# Altium project flyback_main_PS.PrjPcb
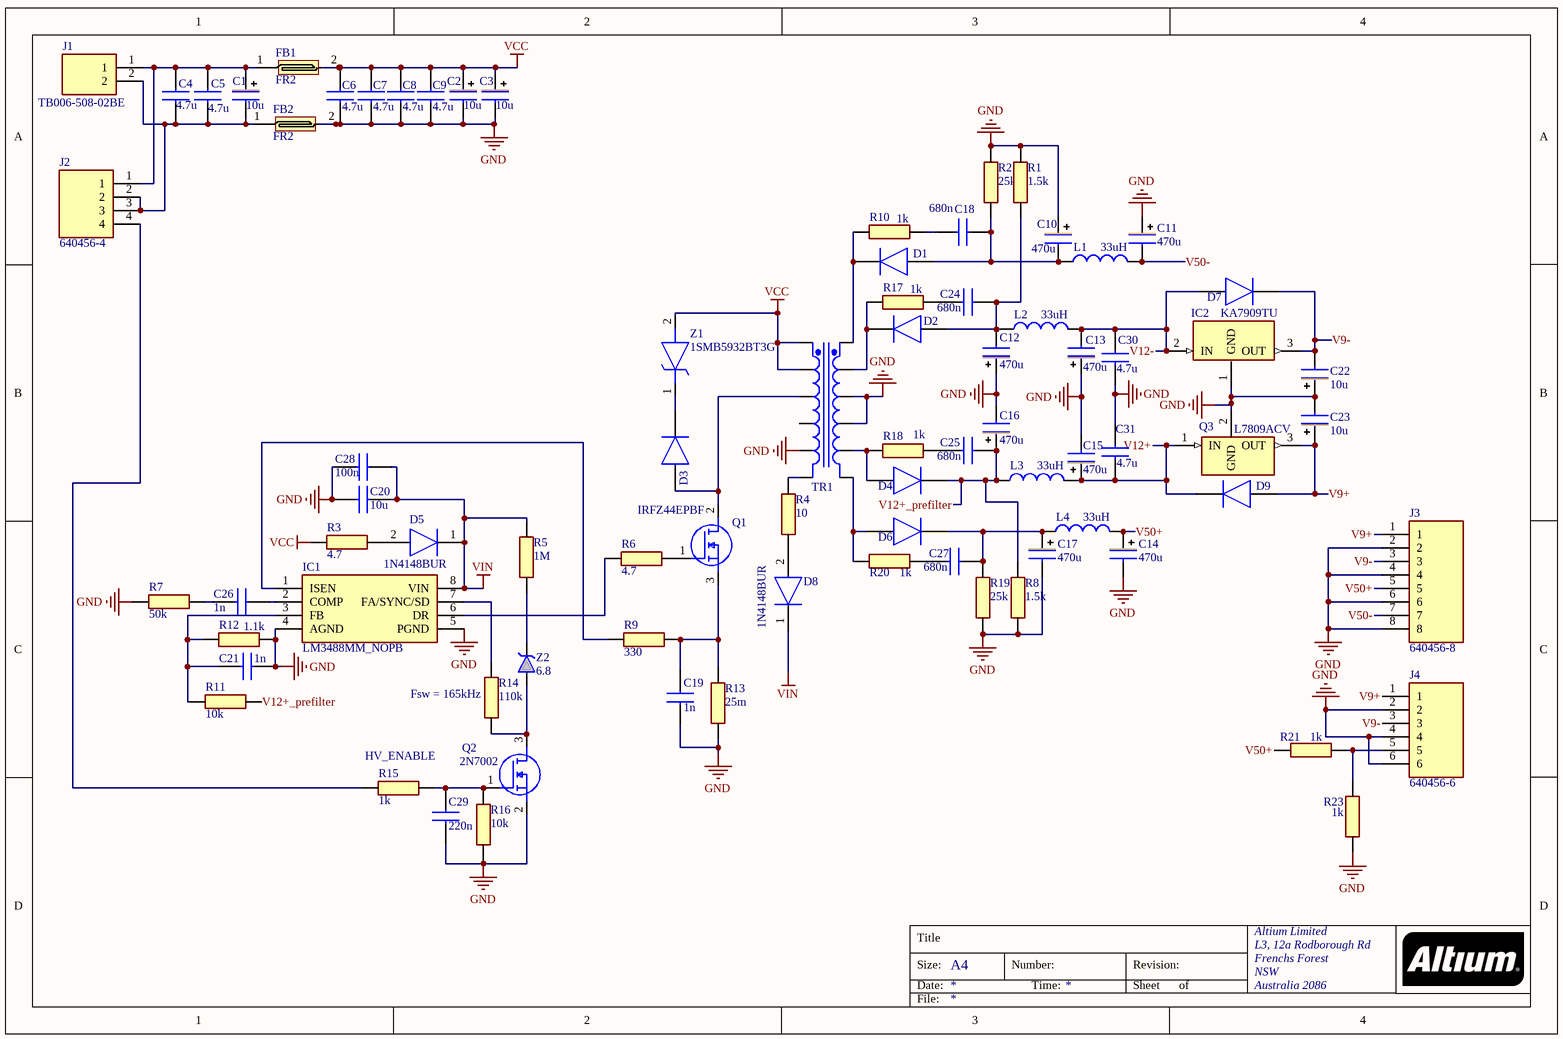
[diagram p0: PS.SchDoc]
1 sheet, 80 parts. Net scope: global (net labels, ports and power ports of the same name join across sheets).
Board file: PS.PcbDoc

## Sheet PS.SchDoc
size A4; Organization: Altium Limited; Address1: L3, 12a Rodborough Rd; Address2: Frenchs Forest; Address3: NSW; Address4: Australia 2086

### Parts
C1  value 10u  [CapPol8mm]  (hidden comment: CapPol)
C2  value 10u  [CapPol8mm]  (hidden comment: CapPol)
C3  value 10u  [CapPol8mm]  (hidden comment: CapPol)
C4  value 4.7u  [CAPC2012X140N]  (hidden comment: Capacitor_SMD)
C5  value 4.7u  [CAPC2012X140N]  (hidden comment: Capacitor_SMD)
C6  value 4.7u  [CAPC2012X140N]  (hidden comment: Capacitor_SMD)
C7  value 4.7u  [CAPC2012X140N]  (hidden comment: Capacitor_SMD)
C8  value 4.7u  [CAPC2012X140N]  (hidden comment: Capacitor_SMD)
C9  value 4.7u  [CAPC2012X140N]  (hidden comment: Capacitor_SMD)
C10  value 470u  [Cap_pol_5x13]  (hidden comment: CapPol)
C11  value 470u  [Cap_pol_5x13]  (hidden comment: CapPol)
C12  value 470u  [CapPol_D10H16]  (hidden comment: CapPol)
C13  value 470u  [CapPol_D10H16]  (hidden comment: CapPol)
C14  value 470u  [Cap_pol_5x13]  (hidden comment: CapPol)
C15  value 470u  [CapPol_D10H16]  (hidden comment: CapPol)
C16  value 470u  [CapPol_D10H16]  (hidden comment: CapPol)
C17  value 470u  [Cap_pol_5x13]  (hidden comment: CapPol)
C18  value 680n  [CAPC3216X95N]  (hidden comment: Capacitor_SMD)
C19  value 1n  [CAPC2012X140N]  (hidden comment: Capacitor_SMD)
C20  value 10u  [CAPC2012X140N]  (hidden comment: Capacitor_SMD)
C21  value 1n  [CAPC2012X140N]  (hidden comment: Capacitor_SMD)
C22  value 10u  [CapPol_D10H16]  (hidden comment: CapPol)
C23  value 10u  [CapPol_D10H16]  (hidden comment: CapPol)
C24  value 680n  [CAPC3216X95N]  (hidden comment: Capacitor_SMD)
C25  value 680n  [CAPC3216X95N]  (hidden comment: Capacitor_SMD)
C26  value 1n  [CAPC2012X140N]  (hidden comment: Capacitor_SMD)
C27  value 680n  [CAPC3216X95N]  (hidden comment: Capacitor_SMD)
C28  value 100n  [CAPC2012X140N]  (hidden comment: Capacitor_SMD)
C29  value 220n  [CAPC2012X140N]  (hidden comment: Capacitor_SMD)
C30  value 4.7u  [CAPC3216X95N]  (hidden comment: Capacitor_SMD)
C31  value 4.7u  [CAPC3216X95N]  (hidden comment: Capacitor_SMD)
D1  SS1200-LTP  [DIOM5226X244N]  (value not drawn)
D2  S2B-13-F  [DIOM5336X250N]  (value not drawn)
D3  SS1200-LTP  [DIOM5226X244N]  (value not drawn)
D4  S2B-13-F  [DIOM5336X250N]  (value not drawn)
D5  1N4148BUR  [1N4148BUR]
D6  SS1200-LTP  [DIOM5226X244N]  (value not drawn)
D7  SS1200-LTP  [DIOM5226X244N]  (value not drawn)
D8  1N4148BUR  [1N4148BUR]
D9  SS1200-LTP  [DIOM5226X244N]  (value not drawn)
FB1  FR2  [FB2]
FB2  FR2  [FB2]
IC1  LM3488MM_NOPB  [SOP65P490X110-8N]
IC2  KA7909TU  [TO254P470X1016X2019-3P]
J1  TB006-508-02BE  [TB00650802BE]
J2  640456-4  [SHDR4W66P0X254_1X4_1016X572X1041P]
J3  640456-8  [SHDR8W66P0X254_1X8_2032X572X1024P]
J4  640456-6  [SHDR6W66P0X254_1X6_1524X572X1003P]
L1  value 33uH  [TYA3015150M]  (hidden comment: Inductor)
L2  value 33uH  [TYA3015150M]  (hidden comment: Inductor)
L3  value 33uH  [TYA3015150M]  (hidden comment: Inductor)
L4  value 33uH  [TYA3015150M]  (hidden comment: Inductor)
Q1  IRFZ44EPBF  [TO254P469X1042X1967-3P]
Q2  2N7002  [SOT96P240X120-3N]
Q3  L7809ACV  [TO255P460X1020X2030-3P]
R1  value 1.5k  [RESC3216X75N]  (hidden comment: Res_SMD)
R2  value 25k  [RESC3216X75N]  (hidden comment: Res_SMD)
R3  value 4.7  [RESC2012X60N]  (hidden comment: Res_SMD)
R4  value 10  [RESC2012X60N]  (hidden comment: Res_SMD)
R5  value 1M  [RESC2012X60N]  (hidden comment: Res_SMD)
R6  value 4.7  [RESC2012X60N]  (hidden comment: Res_SMD)
R7  value 50k  [RESC2012X60N]  (hidden comment: Res_SMD)
R8  value 1.5k  [RESC3216X75N]  (hidden comment: Res_SMD)
R9  value 330  [RESC2012X60N]  (hidden comment: Res_SMD)
R10  value 1k  [RESC5025X65N]  (hidden comment: Res_SMD)
R11  value 10k  [RESC2012X60N]  (hidden comment: Res_SMD)
R12  value 1.1k  [RESC2012X60N]  (hidden comment: Res_SMD)
R13  value 25m  [RESC6331X75N]  (hidden comment: Res_SMD)
R14  value 110k  [RESC2012X60N]  (hidden comment: Res_SMD)
R15  value 1k  [RESC2012X60N]  (hidden comment: Res_SMD)
R16  value 10k  [RESC2012X60N]  (hidden comment: Res_SMD)
R17  value 1k  [RESC5025X65N]  (hidden comment: Res_SMD)
R18  value 1k  [RESC5025X65N]  (hidden comment: Res_SMD)
R19  value 25k  [RESC3216X75N]  (hidden comment: Res_SMD)
R20  value 1k  [RESC5025X65N]  (hidden comment: Res_SMD)
R21  value 1k  [RESC3216X75N]  (hidden comment: Res_SMD)
R23  value 1k  [RESC3216X75N]  (hidden comment: Res_SMD)
TR1  Transformer 12pin30.15.7  [TRAFO5mmX25mm12pcs]  (value not drawn)
Z1  1SMB5932BT3G  [DIOM5436X247N]
Z2  value 6.8  [SOD-80]  (hidden comment: Zener)

### Nets
GND: C2.2(-) C3.2(-) C6.1 C7.1 C8.1 C9.1 C10.1(+) C11.1(+) C12.1(+) C13.1(+) C14.2(-) C15.2(-) C16.2(-) C17.2(-) C19.1 C20.1 C21.2 C22.1(+) C23.2(-) C28.1 C29.1 C30.1 C31.2 FB2.2 IC1.4(AGND) IC1.5(PGND) IC2.1(GND) J3.2 J3.4 J3.6 J3.8 J4.2 J4.4 J4.6 Q2.2(S) Q3.2(GND) R1.2 R2.2 R7.1 R8.1 R12.1 R13.1 R16.1 R19.1 R23.2 TR1.5 TR1.9 TR1.10
VCC: C2.1(+) C3.1(+) C6.2 C7.2 C8.2 C9.2 FB1.2 R3.2 TR1.1 TR1.2 Z1.2(A)
VIN: C20.2 C28.2 D5.1(K) D8.1(K) IC1.8(VIN) R5.2
V9+: C23.1(+) D9.2(A) J3.1 J4.1 Q3.3(OUT)
V9-: C22.2(-) D7.1(K) IC2.3(OUT) J3.3 J4.3
V12+: C15.1(+) C31.1 D9.1(K) L3.2 Q3.1(IN)
V12+_prefilter: C16.1(+) C25.1 D4.1(K) L3.1 R8.2 R11.2
V12-: C13.2(-) C30.2 D7.2(A) IC2.2(IN) L2.2
V50+: C14.1(+) J3.5 L4.2 R21.2
V50-: C11.2(-) J3.7 L1.2
NetC1_1: C1.1(+) C4.2 C5.2 FB1.1 J1.1 J2.1
NetC1_2: C1.2(-) C4.1 C5.1 FB2.1 J1.2 J2.2 J2.3
NetC10_2: C10.2(-) C18.1 D1.2(A) L1.1 R2.1
NetC12_2: C12.2(-) C24.1 D2.2(A) L2.1 R1.1
NetC17_1: C17.1(+) C27.2 D6.1(K) L4.1 R19.2
NetC18_2: C18.2 R10.1
NetC19_2: C19.2 Q1.3(S) R9.2 R13.2
NetC21_1: C21.1 IC1.3(FB) R11.1 R12.2
NetC24_2: C24.2 R17.1
NetC25_2: C25.2 R18.1
NetC26_1: C26.1 R7.2
NetC26_2: C26.2 IC1.2(COMP)
NetC27_1: C27.1 R20.1
NetC29_2: C29.2 Q2.1(G) R15.2 R16.2
NetD1_1: D1.1(K) R10.2 TR1.12
NetD2_1: D2.1(K) R17.2 TR1.11
NetD3_1: D3.1(K) Z1.1(K)
NetD3_2: D3.2(A) Q1.2(D) TR1.3
NetD4_2: D4.2(A) R18.2 TR1.8
NetD5_2: D5.2(A) R3.1
NetD6_2: D6.2(A) R20.2 TR1.7
NetD8_2: D8.2(A) R4.1
NetIC1_1: IC1.1(ISEN) R9.1
NetIC1_6: IC1.6(DR) R6.1
NetIC1_7: IC1.7(FA/SYNC/SD) R14.2
NetJ2_4: J2.4 R15.1
NetJ4_5: J4.5 R21.1 R23.1
NetQ1_1: Q1.1(G) R6.2
NetQ2_3: Q2.3(D) R14.1 Z2.2(A)
NetR4_2: R4.2 TR1.6
NetR5_1: R5.1 Z2.1(K)

Not connected (* = marked no-connect by the designer): TR1 4

### Notes on the sheet
- (near R14) Fsw = 165kHz
- (near R15) HV_ENABLE
- Title
- Size:
- Date:
- A4
- Number:
- Time:
- Revision:
- Sheet
- of
- File:

### Library data of the parts
C1-C3 C10-C17 C22 C23 = CapPol: Capacitor polarized electrolytic; Manufacturer_Name: TDK; Manufacturer_Part_Number: B43640A9477M; Datasheet Link: https://componentsearchengine.com/Datasheets/1/B43640A9477M.pdf; Height: 52mm; Mouser Part Number: 871-B43640A9477M
C4-C9 C18-C21 C24-C31 = Capacitor_SMD: Capacitor smd ceramic; Manufacturer_Name: TDK; Manufacturer_Part_Number: C3216C0G1H562J060AA; Datasheet Link: https://product.tdk.com/info/en/catalog/datasheets/mlcc_commercial_midvoltage_en.pdf; Height: 0.75mm
D1 D3 D6 D7 D9 = SS1200-LTP: Diode; Manufacturer_Name: Micro Commercial Components (MCC); Datasheet Link: http://www.mouser.com/ds/2/258/SS1150-L-SS1200-L(DO-214AC)-272760.pdf; Height: 2.44mm; Manufacturer_Part_Number: SS1200-LTP; Mouser Part Number: 833-SS1200-LTP; Mouser Price/Stock: https://www.mouser.co.uk/ProductDetail/Micro-Commercial-Components-MCC/SS1200-LTP?qs=O1HRStiETChHpHSSFKYx%252Bg%3D%3D; Arrow Part Number: SS1200-LTP; Arrow Price/Stock: https://www.arrow.com/en/products/ss1200-ltp/micro-commercial-components
D2 D4 = S2B-13-F: Diode; Manufacturer_Name: Diodes Inc.; Datasheet Link: https://www.diodes.com/assets/Datasheets/ds16004.pdf; Height: 2.5mm; Manufacturer_Part_Number: S2B-13-F; Mouser Part Number: 621-S2B-F; Mouser Price/Stock: https://www.mouser.com/Search/Refine.aspx?Keyword=621-S2B-F; Arrow Part Number: S2B-13-F; Arrow Price/Stock: https://www.arrow.com/en/products/s2b-13-f/diodes-incorporated
D5 D8 = 1N4148BUR: Diode; Manufacturer_Name: Vishay; Datasheet Link: https://www.mouser.com/datasheet/2/427/ll4148-1767723.pdf; Height: 1.6mm; Manufacturer_Part_Number: 1N4148BUR
FB1 FB2 = FR2: THT ferrite bead
IC1 = LM3488MM_NOPB: Integrated Circuit; Manufacturer_Name: Texas Instruments; Manufacturer_Part_Number: LM3488MM/NOPB; Datasheet Link: https://www.ti.com/lit/ds/symlink/lm3488.pdf?HQS=TI-null-null-mousermode-df-pf-null-wwe&ts=1601467154043&ref_url=https%253A%252F%252Fwww.mouser.in%252F; Height: 1.1mm; Arrow Part Number: LM3488MM/NOPB; Arrow Price/Stock: https://www.arrow.com/en/products/lm3488mmnopb/texas-instruments; Mouser Part Number: 926-LM3488MM/NOPB; Mouser Price/Stock: https://www.mouser.co.uk/ProductDetail/Texas-Instruments/LM3488MM-NOPB?qs=X1J7HmVL2ZHi%252BCD2w7rKZg%3D%3D
IC2 = KA7909TU: Integrated Circuit; Manufacturer_Name: ON Semiconductor; Datasheet Link: https://docs-emea.rs-online.com/webdocs/14a6/0900766b814a6786.pdf; Height: 4.7mm; Manufacturer_Part_Number: KA7909TU; Mouser Part Number: 512-KA7909TU; Mouser Price/Stock: https://www.mouser.com/Search/Refine.aspx?Keyword=512-KA7909TU
J1 = TB006-508-02BE: Connector; Manufacturer_Name: CUI Devices; Datasheet Link: https://www.mouser.com/datasheet/2/670/tb006-508-1550645.pdf; Height: 10.4mm; Manufacturer_Part_Number: TB006-508-02BE; Arrow Part Number: TB006-508-02BE; Arrow Price/Stock: https://www.arrow.com/en/products/tb006-508-02be/cui-devices; Mouser Part Number: 490-TB006-508-02BE; Mouser Price/Stock: https://www.mouser.co.uk/ProductDetail/CUI-Devices/TB006-508-02BE?qs=vLWxofP3U2wEdOVV%2FaT04w%3D%3D
J2 = 640456-4: Connector; Manufacturer_Name: TE Connectivity; Datasheet Link: http://www.te.com/commerce/DocumentDelivery/DDEController?Action=showdoc&DocId=Customer+Drawing%7F640456%7FW3%7Fpdf%7FEnglish%7FENG_CD_640456_W3.pdf%7F640456-4; Height: 10.414mm; Manufacturer_Part_Number: 640456-4; Mouser Part Number: 571-6404564; Mouser Price/Stock: https://www.mouser.co.uk/ProductDetail/TE-Connectivity-AMP/640456-4?qs=%2F35zJ5USjokX5rl%252BbVBc4g%3D%3D; Arrow Part Number: 640456-4; Arrow Price/Stock: https://www.arrow.com/en/products/640456-4/te-connectivity; System: Connector
J3 = 640456-8: Connector; Manufacturer_Name: TE Connectivity; Datasheet Link: http://docs-emea.rs-online.com/webdocs/13e2/0900766b813e2516.pdf; Height: 10.236mm; Manufacturer_Part_Number: 640456-8; Mouser Part Number: 571-6404568; Mouser Price/Stock: https://www.mouser.co.uk/ProductDetail/TE-Connectivity-AMP/640456-8?qs=%2F35zJ5USjomho1287DA4QA%3D%3D; Arrow Part Number: 640456-8; Arrow Price/Stock: https://www.arrow.com/en/products/640456-8/te-connectivity; System: Connector
J4 = 640456-6: Connector; Manufacturer_Name: TE Connectivity; Datasheet Link: https://www.mouser.com/ProductDetail/TE-Connectivity/640456-6?qs=%2F35zJ5USjomb%252bGgX%252bBnrrQ%3D%3D&gclid=CjwKCAjwkoz7BRBPEiwAeKw3q0mcLif-2aBBbbX-TwuIeMidB_ARULgbAE-SJPQzeNro84r-4lxoHhoCr1IQAvD_BwE; Height: 10.033mm; Manufacturer_Part_Number: 640456-6; Mouser Part Number: 571-6404566; Mouser Price/Stock: https://www.mouser.co.uk/ProductDetail/TE-Connectivity-AMP/640456-6?qs=%2F35zJ5USjomb%252BGgX%252BBnrrQ%3D%3D; Arrow Part Number: 640456-6; Arrow Price/Stock: https://www.arrow.com/en/products/640456-6/te-connectivity; System: Connector
L1-L4 = Inductor: Code_IEC: 1005; Published: 8-Jun-2000; LatestRevisionDate: 29-May-2009; LatestRevisionNote: IPC-7351 Footprint Added.; PackageReference: 0402-A; Publisher: Altium Limited; PackageDescription: Chip Inductor; Code_JEITA: 0402
Q1 = IRFZ44EPBF: MOSFET (N-Channel); Manufacturer_Name: Infineon; Datasheet Link: https://componentsearchengine.com/Datasheets/2/IRFZ44EPBF.pdf; Height: 4.69mm; Manufacturer_Part_Number: IRFZ44EPBF; Mouser Part Number: 942-IRFZ44EPBF; Mouser Price/Stock: https://www.mouser.co.uk/ProductDetail/Infineon-IR/IRFZ44EPBF?qs=9%252BKlkBgLFf00d8QrWy3wMA%3D%3D; Arrow Part Number: IRFZ44EPBF; Arrow Price/Stock: https://www.arrow.com/en/products/irfz44epbf/infineon-technologies-ag
Q2 = 2N7002: MOSFET (N-Channel); Manufacturer_Name: Vishay; Datasheet Link: https://www.diodes.com/assets/Datasheets/ds11303.pdf; Height: 1.2mm; Manufacturer_Part_Number: 2N7002; Mouser Part Number: 781-2N7002; Mouser Price/Stock: https://www.mouser.co.uk/ProductDetail/Vishay-Siliconix/2N7002?qs=xBpwZ0JX2zKeuvZKtdYLZQ%3D%3D
Q3 = L7809ACV: Transistor; Manufacturer_Name: STMicroelectronics; Datasheet Link: https://componentsearchengine.com/Datasheets/1/L7809ACV.pdf; Height: 4.6mm; Manufacturer_Part_Number: L7809ACV; Mouser Part Number: 511-L7809ACV; Mouser Price/Stock: https://www.mouser.co.uk/ProductDetail/STMicroelectronics/L7809ACV/?qs=arR7071FstcIsO2ME7JR7Q%3D%3D
R1-R21 R23 = Res_SMD: Resistor SMD; Manufacturer_Name: Bourns; Manufacturer_Part_Number: CR1206-FW-1504ELF; Datasheet Link: http://componentsearchengine.com/Datasheets/1/CR1206-FW-1504ELF.pdf; Height: 0.75mm; Mouser Part Number: 652-CR1206FW1504ELF; Mouser Price/Stock: https://www.mouser.co.uk/ProductDetail/Bourns/CR1206-FW-1504ELF/?qs=6oMev5NRZMFfvXkOpYL2%252BA%3D%3D; Arrow Part Number: CR1206-FW-1504ELF; Arrow Price/Stock: https://www.arrow.com/en/products/cr1206-fw-1504elf/bourns
TR1 = Transformer 12pin30.15.7: Transformer EE 30x15x7 WxHxL 12pin
Z1 = 1SMB5932BT3G: Zener Diode; Manufacturer_Name: ON Semiconductor; Datasheet Link: http://www.onsemi.com/pub/Collateral/1SMB5913BT3-D.PDF; Height: 2.47mm; Manufacturer_Part_Number: 1SMB5932BT3G; Mouser Part Number: 863-1SMB5932BT3G; Mouser Price/Stock: https://www.mouser.co.uk/ProductDetail/ON-Semiconductor/1SMB5932BT3G?qs=vLkC5FC1VN%2Fm4oZo18auNg%3D%3D; Arrow Part Number: 1SMB5932BT3G; Arrow Price/Stock: https://www.arrow.com/en/products/1smb5932bt3g/on-semiconductor
Z2 = Zener: Zener Diode; Manufacturer_Name: Vishay; Manufacturer_Part_Number: GLL4739-E3/97; Datasheet Link: https://hu.mouser.com/datasheet/2/427/gll4735-1767862.pdf; Height: 2.67mm; Mouser Part Number: 78-GLL4739-E3/97; Mouser Price/Stock: https://www.mouser.com/Search/Refine.aspx?Keyword=78-GLL4739-E3%2F97